# Altium project ASIC_test_adapter.PrjPcb
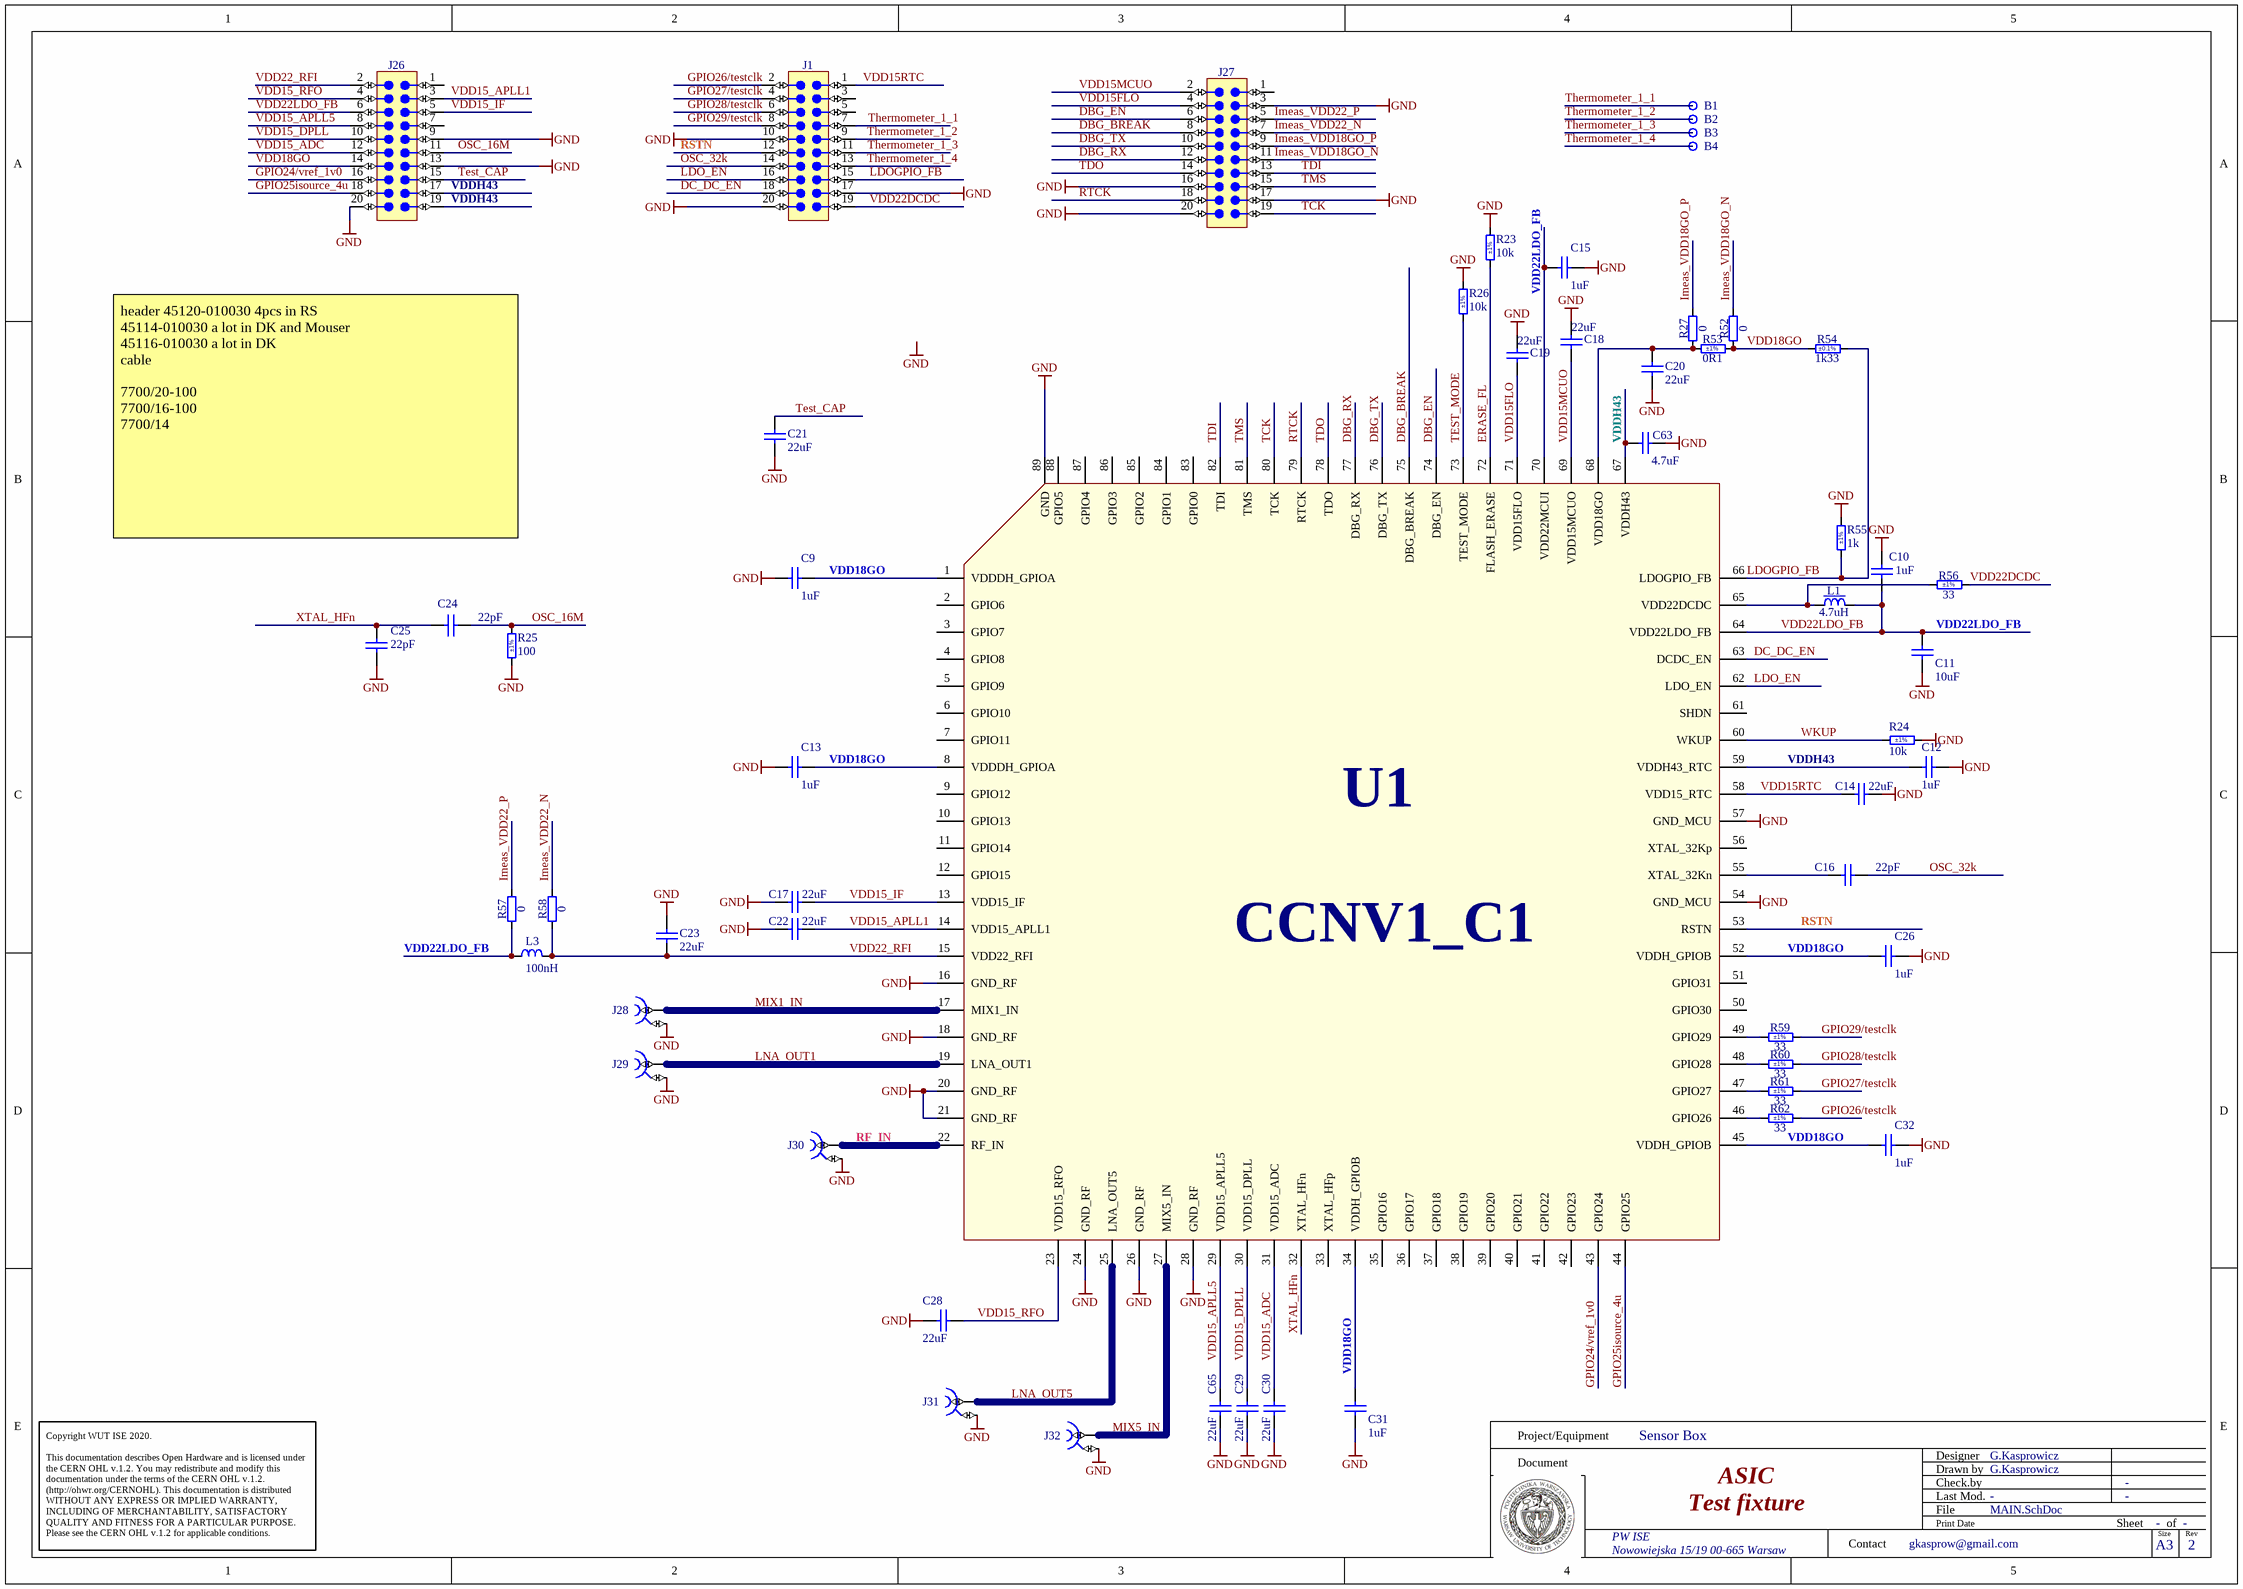
[diagram p0: MAIN.SchDoc]
1 sheet, 56 parts. Net scope: global (net labels, ports and power ports of the same name join across sheets).
Board file: ASIC_test_adapter.PcbDoc

## Sheet MAIN.SchDoc: ASIC
size 420 x 297 mm; Author: G.Kasprowicz; CompanyName: WUT ISE; DrawnBy: G.Kasprowicz; Organization: WUT ISE; Address1: PW ISE; Address2: Nowowiejska 15/19 00-665 Warsaw; Address3: gkasprow@gmail.com; Revision: 2; SheetNumber: -; SheetTotal: -; ModifiedBy: -; CheckedDate: -; Title2: Test fixture; DivGrp: WUT ISE; Designer: G.Kasprowicz; ModifiedDate: -; ProjectName: Sensor Box

### Parts
B1  Plated Hole  [c100h50]  (value not drawn)  (no BOM)
B2  Plated Hole  [c100h50]  (value not drawn)  (no BOM)
B3  Plated Hole  [c100h50]  (value not drawn)  (no BOM)
B4  Plated Hole  [c100h50]  (value not drawn)  (no BOM)
C9  1uF  [CAPC1005X55N]
C10  1uF  [CAPC1005X55N]
C11  10uF  [CAPC1608X80N]
C12  1uF  [CAPC1005X55N]
C13  1uF  [CAPC1005X55N]
C14  22uF  [CAPC1608X90N]
C15  1uF  [CAPC1005X55N]
C16  22pF  [CAPC1005X55N]
C17  22uF  [CAPC1608X90N]
C18  22uF  [CAPC1608X90N]
C19  22uF  [CAPC1608X90N]
C20  22uF  [CAPC1608X90N]
C21  22uF  [CAPC1608X90N]
C22  22uF  [CAPC1608X90N]
C23  22uF  [CAPC1608X90N]
C24  22pF  [CAPC1005X55N]
C25  22pF  [CAPC1005X55N]
C26  1uF  [CAPC1005X55N]
C28  22uF  [CAPC1608X90N]
C29  22uF  [CAPC1608X90N]
C30  22uF  [CAPC1608X90N]
C31  1uF  [CAPC1005X55N]
C32  1uF  [CAPC1005X55N]
C63  4.7uF  [CAPC1005X55N]
C65  22uF  [CAPC1608X90N]
J1  Header 20  [3M_45220-600230]  (value not drawn)
J26  Header 20  [3M_45220-600230]  (value not drawn)
J27  Header 20  [3M_45220-600230]  (value not drawn)
J28  Coax_1Female_1Shield  [SAMTEC_MMCX-J-P-H-ST-TH1]  (value not drawn)
J29  Coax_1Female_1Shield  [SAMTEC_MMCX-J-P-H-ST-TH1]  (value not drawn)
J30  Coax_1Female_1Shield  [SAMTEC_MMCX-J-P-H-ST-TH1]  (value not drawn)
J31  Coax_1Female_1Shield  [SAMTEC_MMCX-J-P-H-ST-TH1]  (value not drawn)
J32  Coax_1Female_1Shield  [SAMTEC_MMCX-J-P-H-ST-TH1]  (value not drawn)
L1  4.7uH  [INDC2012X145N]
L3  100nH  [INDC1005X55N]
R23  10k  Tolerance: ±1%  [RESC1005X40N]
R24  10k  Tolerance: ±1%  [RESC1005X40N]
R25  100  Tolerance: ±1%  [RESC1005X40N]
R26  10k  Tolerance: ±1%  [RESC1005X40N]
R27  0  [RESC1005X40N]
R52  0  [RESC1005X40N]
R53  0R1  Tolerance: ±1%  [RESC1608X55N]
R54  1k33  Tolerance: ±0.1%  [RESC1608X55N]
R55  1k  Tolerance: ±1%  [RESC1005X40N]
R56  33  Tolerance: ±1%  [RESC1005X40N]
R57  0  [RESC1005X40N]
R58  0  [RESC1005X40N]
R59  33  Tolerance: ±1%  [RESC1005X40N]
R60  33  Tolerance: ±1%  [RESC1005X40N]
R61  33  Tolerance: ±1%  [RESC1005X40N]
R62  33  Tolerance: ±1%  [RESC1005X40N]
U1  CCNV1_C1  [QFN88-0,4(10x10) - podstawka 2]

### Nets
GND: C9.2 C10.2 C11.1 C12.2 C13.2 C14.2 C15.1 C17.1 C18.2 C19.2 C20.1 C21.1 C22.1 C23.2 C25.2 C26.1 C28.1 C29.1 C30.1 C31.1 C32.1 C63.1 C65.1 J1.10 J1.17 J1.20 J26.9 J26.13 J26.20 J27.3 J27.16 J27.17 J27.20 J28.2 J29.2 J30.2 J31.2 J32.2 R23.2 R24.2 R25.1 R26.2 R55.2 U1.16(GND_RF) U1.18(GND_RF) U1.20(GND_RF) U1.21(GND_RF) U1.24(GND_RF) U1.26(GND_RF) U1.28(GND_RF) U1.54(GND_MCU) U1.57(GND_MCU) U1.89(GND)
DBG_BREAK: J27.8 U1.75(DBG_BREAK)
DBG_EN: J27.6 U1.74(DBG_EN)
DBG_RX: J27.12 U1.77(DBG_RX)
DBG_TX: J27.10 U1.76(DBG_TX)
DC_DC_EN: J1.18 U1.63(DCDC_EN)
ERASE_FL: R23.1 U1.72(FLASH_ERASE)
GPIO24/vref_1v0: J26.16 U1.43(GPIO24)
GPIO25isource_4u: J26.18 U1.44(GPIO25)
GPIO26/testclk: J1.2 R62.2
GPIO27/testclk: J1.4 R61.2
GPIO28/testclk: J1.6 R60.2
GPIO29/testclk: J1.8 R59.2
Imeas_VDD18GO_N: J27.11 R52.2
Imeas_VDD18GO_P: J27.9 R27.2
Imeas_VDD22_N: J27.7 R58.2
Imeas_VDD22_P: J27.5 R57.2
LDO_EN: J1.16 U1.62(LDO_EN)
LDOGPIO_FB: J1.15 R54.2 R55.1 U1.66(LDOGPIO_FB)
LNA_OUT1: J29.1 U1.19(LNA_OUT1)
LNA_OUT5: J31.1 U1.25(LNA_OUT5)
MIX1_IN: J28.1 U1.17(MIX1_IN)
MIX5_IN: J32.1 U1.27(MIX5_IN)
OSC_16M: C24.1 J26.11 R25.2
OSC_32k: C16.1 J1.14
RF_IN: J30.1 U1.22(RF_IN)
RSTN: J1.12 U1.53(RSTN)
RTCK: J27.18 U1.79(RTCK)
TCK: J27.19 U1.80(TCK)
TDI: J27.13 U1.82(TDI)
TDO: J27.14 U1.78(TDO)
Test_CAP: C21.2 J26.15
TEST_MODE: R26.1 U1.73(TEST_MODE)
Thermometer_1_1: B1.1 J1.7
Thermometer_1_2: B2.1 J1.9
Thermometer_1_3: B3.1 J1.11
Thermometer_1_4: B4.1 J1.13
TMS: J27.15 U1.81(TMS)
VDD15_ADC: C30.2 J26.12 U1.31(VDD15_ADC)
VDD15_APLL1: C22.2 J26.3 U1.14(VDD15_APLL1)
VDD15_APLL5: C65.2 J26.8 U1.29(VDD15_APLL5)
VDD15_DPLL: C29.2 J26.10 U1.30(VDD15_DPLL)
VDD15_IF: C17.2 J26.5 U1.13(VDD15_IF)
VDD15_RFO: C28.2 J26.4 U1.23(VDD15_RFO)
VDD15FLO: C19.1 J27.4 U1.71(VDD15FLO)
VDD15MCUO: C18.1 J27.2 U1.69(VDD15MCUO)
VDD15RTC: C14.1 J1.1 U1.58(VDD15_RTC)
VDD18GO: C9.1 C13.1 C26.2 C31.2 C32.2 J26.14 R52.1 R53.2 R54.1 U1.1(VDDDH_GPIOA) U1.8(VDDDH_GPIOA) U1.34(VDDH_GPIOB) U1.45(VDDH_GPIOB) U1.52(VDDH_GPIOB)
VDD22_RFI: C23.1 J26.2 L3.2 R58.1 U1.15(VDD22_RFI)
VDD22DCDC: J1.19 R56.2
VDD22LDO_FB: C10.1 C11.2 C15.2 J26.6 L1.2 L3.1 R57.1 U1.64(VDD22LDO_FB) U1.70(VDD22MCUI)
VDDH43: C12.1 C63.2 J26.17 J26.19 U1.59(VDDH43_RTC) U1.67(VDDH43)
WKUP: R24.1 U1.60(WKUP)
XTAL_HFn: C24.2 C25.1 U1.32(XTAL_HFn)
NetC16_2: C16.2 U1.55(XTAL_32Kn)
NetC20_2: C20.2 R27.1 R53.1 U1.68(VDD18GO)
NetL1_1: L1.1 R56.1 U1.65(VDD22DCDC)
NetR59_1: R59.1 U1.49(GPIO29)
NetR60_1: R60.1 U1.48(GPIO28)
NetR61_1: R61.1 U1.47(GPIO27)
NetR62_1: R62.1 U1.46(GPIO26)

Not connected (* = marked no-connect by the designer): J1 3 5; J26 1 7; J27 1; U1 2(GPIO6) 3(GPIO7) 4(GPIO8) 5(GPIO9) 6(GPIO10) 7(GPIO11) 9(GPIO12) 10(GPIO13) 11(GPIO14) 12(GPIO15) 33(XTAL_HFp) 35(GPIO16) 36(GPIO17) 37(GPIO18) 38(GPIO19) 39(GPIO20) 40(GPIO21) 41(GPIO22) 42(GPIO23) 50(GPIO30) 51(GPIO31) 56(XTAL_32Kp) 61(SHDN) 83(GPIO0) 84(GPIO1) 85(GPIO2) 86(GPIO3) 87(GPIO4) 88(GPIO5)

### Notes on the sheet
- header 45120-010030 4pcs in RS
  45114-010030 a lot in DK and Mouser
  45116-010030 a lot in DK
  cable
  7700/20-100
  7700/16-100
  7700/14
- Labels drawn without touching a wire or pin: GND
- Project/Equipment
- Document
- Designer
- Drawn by
- Check.by
- Copyright WUT ISE 2020.
  This documentation describes Open Hardware and is licensed under the CERN OHL v.1.2. You may redistribute and modify this documentation under the terms of the CERN OHL v.1.2. (http://ohwr.org/CERNOHL). This documentation is distributed WITHOUT ANY EXPRESS OR IMPLIED WARRANTY, INCLUDING OF MERCHANTABILITY, SATISFACTORY QUALITY AND FITNESS FOR A PARTICULAR PURPOSE. Please see the CERN OHL v.1.2 for applicable conditions.
- Contact
- File
- Last Mod.
- Print Date
- Sheet
- Size
- A3
- of
- Rev

### Library data of the parts
B1-B4 = PLATED_HOLE0.5_PAD1.0: Single Terminal Socket; Part Description: Plated Through Hole: Hole Dia.=0.5mm Pad Dia.=1.0mm; Mounted: No; Part Number: PLATED_HOLE0.5_PAD1.0; Component Type: Standard (No BOM); Pin Count: 1; Family: Plated Hole; Socket: No; SMD: No; Sense: No; Status: None; ComponentHeight: 0mm; HelpURL: Undefined; Author: CERN DEM JMW; CreateDate: 06.01.2020; LatestRevisionDate: 06.01.2020; PackageDescription: Plated Through Hole: Hole Dia.=0.5mm Pad Dia.=1.0mm
C9 C10 C12 C13 C15 C26 C31 C32 = CC0402_1UF_16V_10%_X5R: Non-polarised capacitor; Part Description: SMD Multilayer Chip Ceramic Capacitor; Manufacturer: GENERIC; Manufacturer1 Part Number: C1005X5R1C105KT; Voltage: 16V; TC: X5R; Tolerance: ±10%; Value: 1uF; Part Number: CC0402_1UF_16V_10%_X5R; Component Kind: Standard; Component Type: Standard; Pin Count: 2; Status: Preferred; Manufacturer Part Number: CC0402_1UF_16V_10%_X5R; Case: 0402; Mounted: Yes; Socket: No; SMD: Yes; Sense: No; Manufacturer1 Example: TDK; Manufacturer1 ComponentHeight: 0.55mm; HelpURL: \\cern.ch\dfs\Applications\Altium\Datasheets\CC0402_X5R_TDK_C.pdf; Author: CERN DEM JLC; CreateDate: 25.10.2012; LatestRevisionDate: 25.10.2012
C11 = CC0603_10UF_10V_10%_X5R: Non-polarised capacitor; Part Description: SMD Multilayer Chip Ceramic Capacitor; Manufacturer: GENERIC; Manufacturer1 Part Number: GRM188R61A106KE69D; Voltage: 10V; TC: X5R; Tolerance: ±10%; Value: 10uF; Part Number: CC0603_10UF_10V_10%_X5R; Component Kind: Standard; Component Type: Standard; Pin Count: 2; Status: None; Manufacturer Part Number: CC0603_10UF_10V_10%_X5R; Case: 0603; Mounted: Yes; Socket: No; SMD: Yes; Sense: No; Manufacturer1 Example: MURATA; Manufacturer1 ComponentHeight: 0.8mm; HelpURL: \\cern.ch\dfs\Applications\Altium\Datasheets\CC0603_MURATA_GRM188R61A106KE69D.pdf; Author: CERN DEM JLC; CreateDate: 31.01.2017; LatestRevisionDate: 31.01.2017
C14 C17-C23 C28-C30 C65 = CC0603_22UF_10V_20%_X5R: Non-polarised capacitor; Part Description: SMD Multilayer Chip Ceramic Capacitor; Manufacturer: GENERIC; Manufacturer1 Part Number: C1608X5R1A226M080; Voltage: 10V; TC: X5R; Tolerance: ±20%; Value: 22uF; Part Number: CC0603_22UF_10V_20%_X5R; Component Kind: Standard; Component Type: Standard; Pin Count: 2; Status: None; Manufacturer Part Number: CC0603_22UF_10V_20%_X5R; Case: 0603; Mounted: Yes; Socket: No; SMD: Yes; Sense: No; Manufacturer1 Example: TDK; Manufacturer1 ComponentHeight: 0.9mm; HelpURL: \\cern.ch\dfs\Applications\Altium\Datasheets\CC0603_X5R_TDK_C.pdf; Author: CERN DEM BC; CreateDate: 03.12.2020; LatestRevisionDate: 03.12.2020
C16 C24 C25 = CC0402_22PF_50V_5%_C0G: Non-polarised capacitor; Part Description: SMD Multilayer Chip Ceramic Capacitor; Manufacturer: GENERIC; Manufacturer1 Part Number: C0402C220J5GACTU; Voltage: 50V; TC: C0G/NP0; Tolerance: ±5%; Value: 22pF; Part Number: CC0402_22PF_50V_5%_C0G; Component Kind: Standard; Component Type: Standard; Pin Count: 2; Status: Preferred; Manufacturer Part Number: CC0402_22PF_50V_5%_C0G; Case: 0402; Mounted: Yes; Socket: No; SMD: Yes; Sense: No; Manufacturer1 Example: KEMET; Manufacturer1 ComponentHeight: 0.55mm; HelpURL: \\cern.ch\dfs\Applications\Altium\Datasheets\CC0402_C0G_KEMET_(Commercial Grade).pdf; Author: CERN DEM JLC; CreateDate: 03.12.2007; LatestRevisionDate: 03.12.2007
C63 = CC0402_4.7UF_10V_10%_X5R: Non-polarised capacitor; Part Description: SMD Multilayer Chip Ceramic Capacitor; Manufacturer: GENERIC; Manufacturer1 Part Number: C1005X5R1A475K050; Voltage: 10V; TC: X5R; Tolerance: ±10%; Value: 4.7uF; Part Number: CC0402_4.7UF_10V_10%_X5R; Component Kind: Standard; Component Type: Standard; Pin Count: 2; Status: Preferred; Manufacturer Part Number: CC0402_4.7UF_10V_10%_X5R; Case: 0402; Mounted: Yes; Socket: No; SMD: Yes; Sense: No; Manufacturer1 Example: TDK; Manufacturer1 ComponentHeight: 0.65mm; HelpURL: \\cern.ch\dfs\Applications\Altium\Datasheets\CC0402_X5R_TDK_C.pdf; Author: CERN DEM BC; CreateDate: 10.01.2020; LatestRevisionDate: 10.01.2020
J1 J26 J27 = 3M_45220-600230: Connector 20 Male; Part Description: 20 Contacts - 1.27mm (0.050") Pitch - Shrouded Boardmount Vertical Header Without Latch/Ejectors, 452 Series; Manufacturer: 3M; PressFit: No; Part Number: 3M_45220-600230; Component Kind: Standard; Component Type: Standard; Pin Count: 20; Family: Header 20; Mounted: Yes; Socket: No; SMD: No; Sense: No; Status: None; Manufacturer Part Number: 45220-600230; ComponentHeight: 5.64mm; HelpURL: \\cern.ch\dfs\Applications\Altium\Datasheets\3M_45220-600230.pdf; Author: CERN DEM MR; CreateDate: 15.08.2019; LatestRevisionDate: 15.08.2019
J28-J32 = SAMTEC_MMCX-J-P-H-ST-TH1: Part Description: Straight Through-hole 50 Ohm Micro Mini RF Jack, MMCX Series; Manufacturer: SAMTEC; PressFit: No; Part Number: SAMTEC_MMCX-J-P-H-ST-TH1; Component Kind: Standard; Component Type: Standard; Pin Count: 2; Mounted: Yes; Socket: No; SMD: No; Sense: No; Status: None; Manufacturer Part Number: MMCX-J-P-H-ST-TH1; ComponentHeight: 4.35mm; HelpURL: \\cern.ch\dfs\Applications\Altium\Datasheets\SAMTEC_MMCX-J-P-H-ST-TH1.pdf; Author: CERN DEM JLC; CreateDate: 05.12.2012; LatestRevisionDate: 05.12.2012
L1 = IND0805_4.7UH_20%_KEMET_L-DWI: Inductor With Core; Part Description: Wire Wound Chip Inductors; Manufacturer: KEMET; Manufacturer Part Number: L0805C4R7MDWIT; Power: 360mA; Resistance: 0.5R; Tolerance: ±20%; Part Number: IND0805_4.7UH_20%_KEMET_L-DWI; Component Kind: Standard; Component Type: Standard; Pin Count: 2; Value: 4.7uH; Case: 0805; Mounted: Yes; Socket: No; SMD: Yes; Sense: No; ComponentHeight: 1.85mm; HelpURL: \\cern.ch\dfs\Applications\Altium\Datasheets\IND0805_KEMET_L-DWI .pdf; Author: CERN DEM JLC; CreateDate: 26.01.2010; LatestRevisionDate: 26.01.2010
L3 = IND0402_100NH_5%_TDK_MLJ1005: Inductor; Part Description: SMD Inductor for Standard Circuits, MLJ Series; Manufacturer: TDK; Manufacturer Part Number: MLJ1005WR10J; Power: 400mA; Resistance: 0.30R; Tolerance: ±5%; Value: 100nH; Part Number: IND0402_100NH_5%_TDK_MLJ1005; Component Kind: Standard; Component Type: Standard; Pin Count: 2; Case: 0402; Mounted: Yes; Socket: No; SMD: Yes; Sense: No; ComponentHeight: 0.55mm; HelpURL: \\cern.ch\dfs\Applications\Altium\Datasheets\IND0402_TDK_MLJ1005.pdf; Author: CERN DEM BC; CreateDate: 13.07.2020; LatestRevisionDate: 13.07.2020
R23 R24 R26 = R0402_10K_1%_0.0625W_100PPM: Resistor - 1%; Part Description: General Purpose Thick Film Chip Resistor; Manufacturer: GENERIC; Manufacturer1 Part Number: 232270671003L; TC: ±100ppm/°C; PressFit: No; Value: 10k; Part Number: R0402_10K_1%_0.0625W_100PPM; Component Kind: Standard; Component Type: Standard; Pin Count: 2; Status: Not Recommended; Power: 0.0625W; Manufacturer Part Number: R0402_10K_1%_0.0625W_100PPM; Case: 0402; Mounted: Yes; Sense: No; Socket: No; SMD: Yes; Manufacturer1 Example: YAGEO PHYCOMP; Manufacturer1 ComponentHeight: 0.4mm; HelpURL: \\cern.ch\dfs\Applications\Altium\Datasheets\R0402_Phycomp_RC0402.pdf; Author: CERN DEM JLC; CreateDate: 03.12.2007; LatestRevisionDate: 17.10.2012
R25 = R0402_100R_1%_0.0625W_100PPM: Resistor - 1%; Part Description: General Purpose Thick Film Chip Resistor; Manufacturer: GENERIC; Manufacturer1 Part Number: 232270671001L; TC: ±100ppm/°C; PressFit: No; Value: 100; Part Number: R0402_100R_1%_0.0625W_100PPM; Component Kind: Standard; Component Type: Standard; Pin Count: 2; Status: Not Recommended; Power: 0.0625W; Manufacturer Part Number: R0402_100R_1%_0.0625W_100PPM; Case: 0402; Mounted: Yes; Sense: No; Socket: No; SMD: Yes; Manufacturer1 Example: YAGEO PHYCOMP; Manufacturer1 ComponentHeight: 0.4mm; HelpURL: \\cern.ch\dfs\Applications\Altium\Datasheets\R0402_Phycomp_RC0402.pdf; Author: CERN DEM JLC; CreateDate: 03.12.2007; LatestRevisionDate: 17.10.2012
R27 R52 R57 R58 = R0402_0R_JUMPER: Resistor; Part Description: 1A (0.05R Max DC Resistance) Zero Ohm Jumper; Manufacturer: GENERIC; Manufacturer1 Part Number: 232270591001L; PressFit: No; Part Number: R0402_0R_JUMPER; Component Kind: Standard; Component Type: Standard; Pin Count: 2; Value: 0; Status: Not Recommended; Manufacturer Part Number: R0402_0R_JUMPER; Case: 0402; Mounted: Yes; Sense: No; Socket: No; SMD: Yes; Manufacturer1 Example: YAGEO PHYCOMP; Manufacturer1 ComponentHeight: 0.4mm; HelpURL: \\cern.ch\dfs\Applications\Altium\Datasheets\R0402_Phycomp_RC0402.pdf; Author: CERN DEM JLC; CreateDate: 03.12.2007; LatestRevisionDate: 17.10.2012
R53 = R0603_0R1_1%_0.1W_200PPM: Resistor - 1%; Part Description: Low Value Chip Resistor; Manufacturer: GENERIC; Manufacturer1 Part Number: CRL0603-FW-R100ELF; Power: 0.1W; TC: ±200ppm/°C; PressFit: No; Part Number: R0603_0R1_1%_0.1W_200PPM; Component Kind: Standard; Component Type: Standard; Pin Count: 2; Value: 0R1; Status: Preferred; Manufacturer Part Number: R0603_0R1_1%_0.1W_200PPM; Case: 0603; Mounted: Yes; Sense: No; Socket: No; SMD: Yes; Manufacturer1 Example: BOURNS; Manufacturer1 ComponentHeight: 0.55mm; HelpURL: \\cern.ch\dfs\Applications\Altium\Datasheets\R0603_BOURNS_CRL.pdf; Author: CERN DEM JMW; CreateDate: 26.11.2019; LatestRevisionDate: 26.11.2019
R54 = R0603_1K33_0.1%_0.063W_10PPM: Resistor - 0.1%; Part Description: Thin Film Chip Resistor; Manufacturer: GENERIC; Manufacturer1 Part Number: RN73C1J1K33BTDF; Power: 0.063W; TC: ±10ppm; PressFit: No; Part Number: R0603_1K33_0.1%_0.063W_10PPM; Component Kind: Standard; Component Type: Standard; Pin Count: 2; Value: 1k33; Status: Not Recommended; Manufacturer Part Number: R0603_1K33_0.1%_0.063W_10PPM; Case: 0603; Mounted: Yes; Sense: No; Socket: No; SMD: Yes; Manufacturer1 Example: TYCO HOLSWORTHY; Manufacturer1 ComponentHeight: 0.5mm; HelpURL: \\cern.ch\dfs\Applications\Altium\Datasheets\R0603_Tyco_RN73.pdf; Author: CERN DEM JLC; CreateDate: 03.12.2007; LatestRevisionDate: 13.03.2008
R55 = R0402_1K_1%_0.0625W_100PPM: Resistor - 1%; Part Description: General Purpose Thick Film Chip Resistor; Manufacturer: GENERIC; Manufacturer1 Part Number: 232270671002L; TC: ±100ppm/°C; PressFit: No; Value: 1k; Part Number: R0402_1K_1%_0.0625W_100PPM; Component Kind: Standard; Component Type: Standard; Pin Count: 2; Status: Not Recommended; Power: 0.0625W; Manufacturer Part Number: R0402_1K_1%_0.0625W_100PPM; Case: 0402; Mounted: Yes; Sense: No; Socket: No; SMD: Yes; Manufacturer1 Example: YAGEO PHYCOMP; Manufacturer1 ComponentHeight: 0.4mm; HelpURL: \\cern.ch\dfs\Applications\Altium\Datasheets\R0402_Phycomp_RC0402.pdf; Author: CERN DEM JLC; CreateDate: 03.12.2007; LatestRevisionDate: 17.10.2012
R56 R59-R62 = R0402_33R_1%_0.0625W_100PPM: Resistor - 1%; Part Description: General Purpose Thick Film Chip Resistor; Manufacturer: GENERIC; Manufacturer1 Part Number: 232270673309L; TC: ±100ppm/°C; PressFit: No; Part Number: R0402_33R_1%_0.0625W_100PPM; Component Kind: Standard; Component Type: Standard; Pin Count: 2; Value: 33; Status: Not Recommended; Power: 0.0625W; Manufacturer Part Number: R0402_33R_1%_0.0625W_100PPM; Case: 0402; Mounted: Yes; Sense: No; Socket: No; SMD: Yes; Manufacturer1 Example: YAGEO PHYCOMP; Manufacturer1 ComponentHeight: 0.4mm; HelpURL: \\cern.ch\dfs\Applications\Altium\Datasheets\R0402_Phycomp_RC0402.pdf; Author: CERN DEM JLC; CreateDate: 03.12.2007; LatestRevisionDate: 17.10.2012
U1 = CCNV1_C1: Układ scalony